# EAGLE design AS3364 waveform VCA 0402 DIL v1.0-for design block (EAGLE 9.6.2)
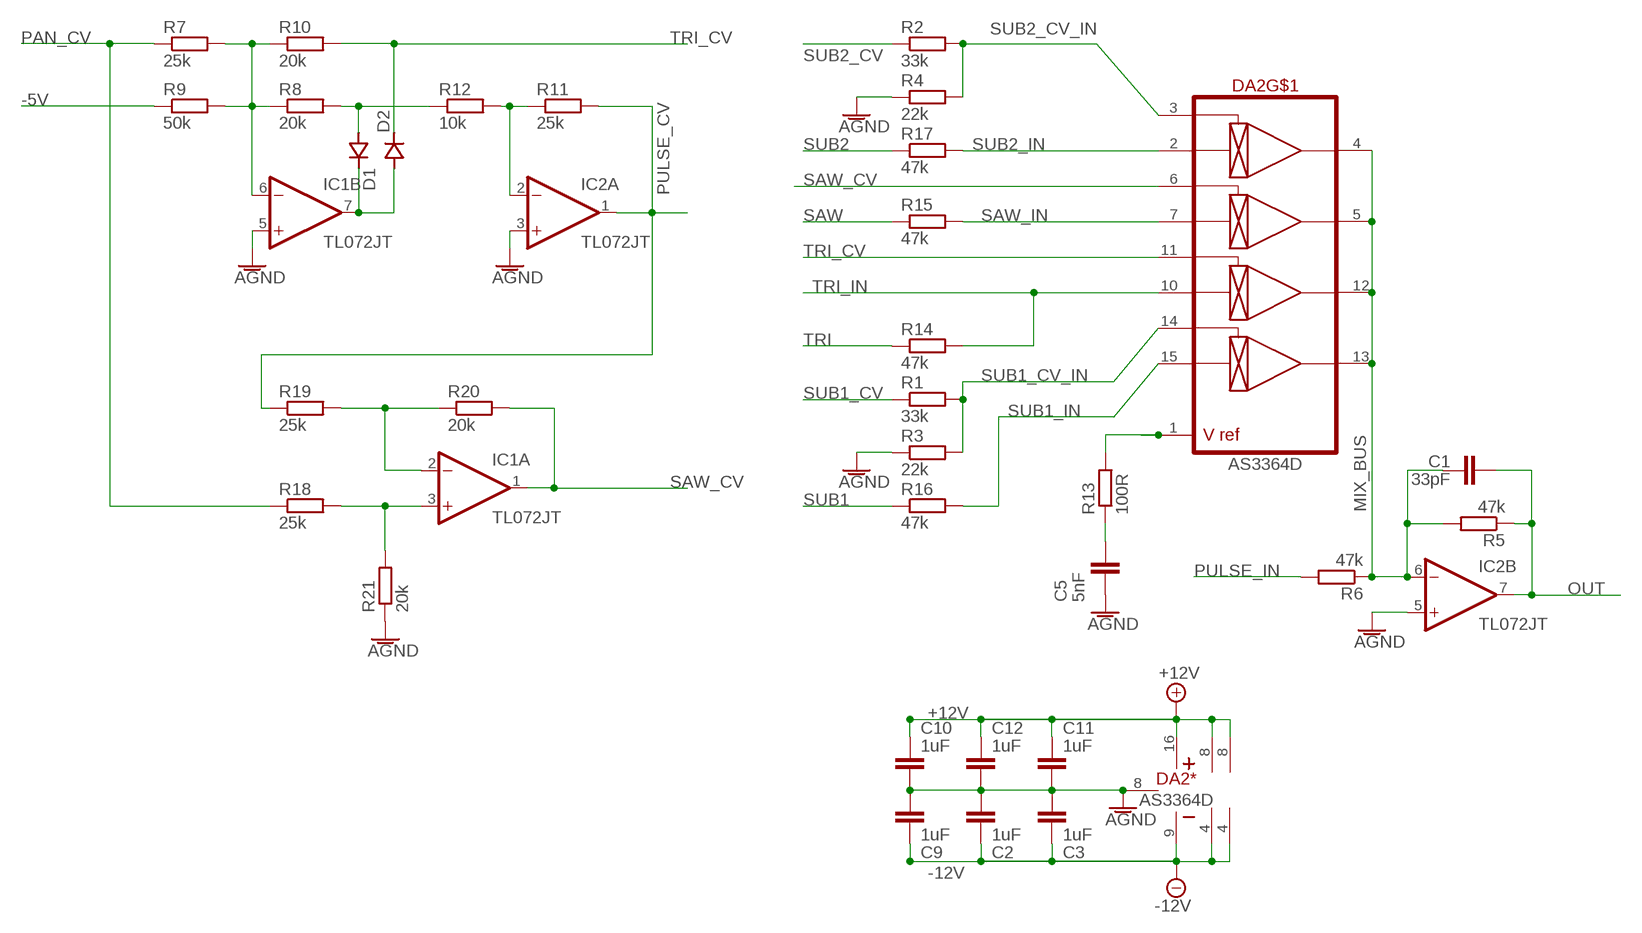
[diagram p0: schematic, sheet 1]

## Parts
C1  33pF  C-EU-J  [C0402-J]
C2  1uF  C-EU-J  [C0402-J]
C3  1uF  C-EU-J  [C0402-J]
C5  5nF  C-EU-J  [C0402-J]
C9  1uF  C-EU-J  [C0402-J]
C10  1uF  C-EU-J  [C0402-J]
C11  1uF  C-EU-J  [C0402-J]
C12  1uF  C-EU-J  [C0402-J]
D1  DIODESOD323  [SOD323J]
D2  DIODESOD323  [SOD323J]
DA2  AS3364D  [DIL16J]
IC1  TL072JT  [TSSOP8J]
IC2  TL072JT  [TSSOP8J]
R1  33k  R-EU_R0402  [R0402]
R2  33k  R-EU_R0402  [R0402]
R3  22k  R-EU_R0402  [R0402]
R4  22k  R-EU_R0402  [R0402]
R5  47k  R-EU_R0402  [R0402]
R6  47k  R-EU_R0402  [R0402]
R7  25k  R-EU_R0402  [R0402]
R8  20k  R-EU_R0402  [R0402]
R9  50k  R-EU_R0402  [R0402]
R10  20k  R-EU_R0402  [R0402]
R11  25k  R-EU_R0402  [R0402]
R12  10k  R-EU_R0402  [R0402]
R13  100R  R-EU_R0402  [R0402]
R14  47k  R-EU_R0402  [R0402]
R15  47k  R-EU_R0402  [R0402]
R16  47k  R-EU_R0402  [R0402]
R17  47k  R-EU_R0402  [R0402]
R18  25k  R-EU_R0402  [R0402]
R19  25k  R-EU_R0402  [R0402]
R20  20k  R-EU_R0402  [R0402]
R21  20k  R-EU_R0402  [R0402]

## Nets
+12V: C10.2 C11.2 C12.2 DA2.16(*:V+) IC1.8(P:V+) IC2.8(P:V+)
-5V: R9.1
-12V: C2.1 C3.1 C9.1 DA2.9(*:V-) IC1.4(P:V-) IC2.4(P:V-)
AGND: C2.2 C3.2 C5.1 C9.2 C10.1 C11.1 C12.1 DA2.8(*:GND) IC1.5(B:+IN) IC2.3(A:+IN) IC2.5(B:+IN) R3.1 R4.1 R21.1
MIX_BUS: C1.2 DA2.4(OUT1) DA2.5(OUT2) DA2.12(OUT3) DA2.13(OUT4) IC2.6(B:-IN) R5.2 R6.1
N$2: DA2.1(VREF) R13.2
N$6: D1.1(C) D2.2(A) IC1.7(B:OUT)
N$8: IC1.6(B:-IN) R7.2 R8.1 R9.2 R10.1
N$11: IC1.3(A:+IN) R18.2 R21.2
N$14: C5.2 R13.1
N$15: IC1.2(A:-IN) R19.2 R20.1
N$18: IC2.2(A:-IN) R11.1 R12.2
N$19: D1.2(A) R8.2 R12.1
OUT: C1.1 IC2.7(B:OUT) R5.1
PAN_CV: R7.1 R18.1
PULSE_CV: IC2.1(A:OUT) R11.2 R19.1
PULSE_IN: R6.2
SAW: R15.1
SAW_CV: DA2.6(CV2) IC1.1(A:OUT) R20.2
SAW_IN: DA2.7(IN2) R15.2
SUB1: R16.1
SUB1_CV: R1.1
SUB1_CV_IN: DA2.14(CV4) R1.2 R3.2
SUB1_IN: DA2.15(IN4) R16.2
SUB2: R17.1
SUB2_CV: R2.1
SUB2_CV_IN: DA2.3(CV1) R2.2 R4.2
SUB2_IN: DA2.2(IN1) R17.2
TRI: R14.1
TRI_CV: D2.1(C) DA2.11(CV3) R10.2
TRI_IN: DA2.10(IN3) R14.2

## Library data of the parts
C1-C3 C5 C9-C12 = joakim:C-EU-J: CAPACITOR, European symbol
D1 D2 = joakim:DIODE: DIODE; MPN: CDSOD323-T05C; OC_FARNELL: 1824860; OC_NEWARK: 79R6078
DA2 = joakim:AS3364: AS3364 quad linear VCA, CEM3360 style. CV is 0 to 2V Vcc-Vee = 26V max, so +/-12V or +15V/-9V
IC1 IC2 = joakim:TL072J: OP AMP
R1-R21 = rcl:R-EU_: RESISTOR, European symbol; SPICEPREFIX: R

## Board
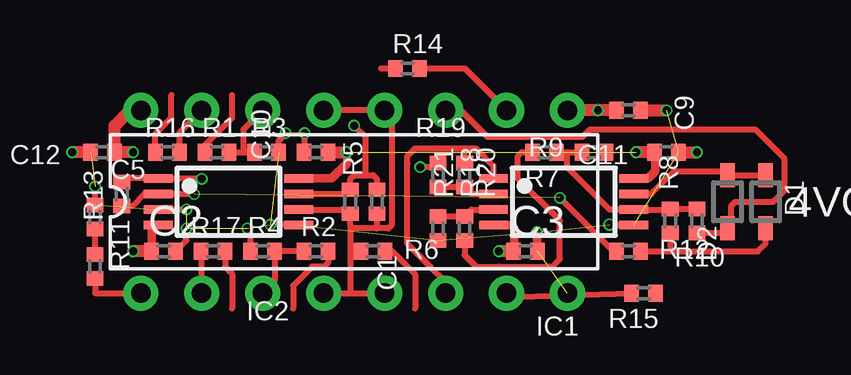
[diagram p1: board, top side]
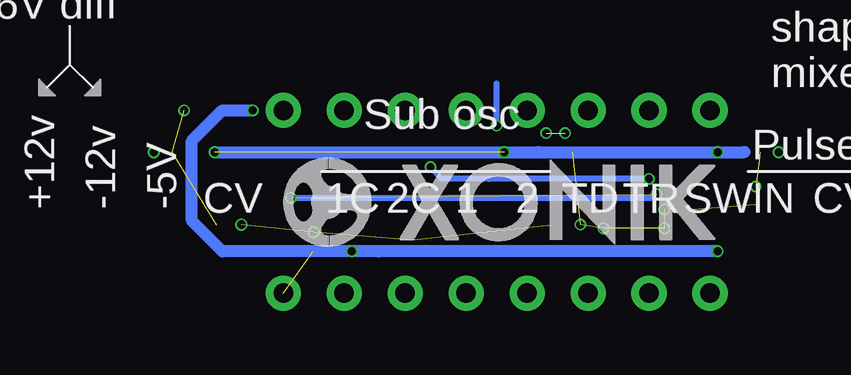
[diagram p2: board, bottom side, seen from below]

No outline drawn. Coordinates in mm, seen from the top.
Copper layers (1*16): Top 0.035mm / dielectric 1.6mm / Bottom 0.035mm
Design rules "jlcpcb-2layers": minimum track width 5mil, minimum drill 0.3mm, track to track 5mil, track to pad 5mil, pad to pad 5mil, via to via 5mil, smd to smd 5mil, copper to edge 0.2mm, drill to drill 6mil, minimum pad ring 10mil, minimum via ring 3mil, stop-mask expansion 4mil, vias tented up to drill 0mil, thermal gap 10mil

### Footprints (pad centres in the part's own frame; a part is rotated, then mirrored left to right if it is on the bottom)
C0402-J = smd 0.6 x 0.7: 1 -0.5,0; 2 0.5,0
SOD323J = smd 1 x 0.6: 1 -1.1,0; 2 1.1,0
DIL16J = drill 0.813: 1 -8.89,-3.81; 2 -6.35,-3.81; 3 -3.81,-3.81; 4 -1.27,-3.81; 5 1.27,-3.81; 6 3.81,-3.81; 7 6.35,-3.81; 8 8.89,-3.81; 9 8.89,3.81; 10 6.35,3.81; 11 3.81,3.81; 12 1.27,3.81; 13 -1.27,3.81; 14 -3.81,3.81; 15 -6.35,3.81; 16 -8.89,3.81
TSSOP8J = smd 1.2 x 0.35: 1 -2.925,0.975; 2 -2.925,0.325; 3 -2.925,-0.325; 4 -2.925,-0.975; 5 2.925,-0.975; 6 2.925,-0.325; 7 2.925,0.325; 8 2.925,0.975
R0402 = smd 0.6 x 0.7: 1 -0.5,0; 2 0.5,0

### Placement (x,y rotation side)
C1  19.05,5.08 270 top
C2  10.16,3.02 0 top
C3  25.24,3.02 0 top
C5  7.3,4.45 270 top
C9  29.53,8.89 0 top
C10  16.51,7.14 0 top
C11  31.11,7.14 180 top
C12  7.62,7.14 0 top
D1  35.24,5.08 270 top
D2  33.66,5.08 90 top
DA2  18.1,5.08 0 top
IC1  26.83,5.08 0 top
IC2  12.86,5.08 0 top
R1  12.38,7.14 0 top
R2  16.51,3.02 180 top
R3  14.45,7.14 180 top
R4  14.29,3.02 0 top
R5  17.94,5.08 270 top
R6  18.89,3.02 0 top
R7  26.04,7.14 0 top
R8  31.27,4.29 270 top
R9  28.1,7.14 180 top
R10  32.38,4.29 270 top
R11  8.41,5.4 90 top
R12  29.53,3.02 180 top
R13  7.3,2.38 270 top
R14  20.32,10.64 0 top
R15  30.16,1.27 180 top
R16  10.32,7.14 0 top
R17  12.22,3.02 180 top
R18  22.7,3.97 90 top
R19  21.59,6.19 270 top
R20  22.7,6.19 90 top
R21  21.59,3.97 90 top
U$1  [XONIK_LOGO_18]  26.99,3.23 0 bottom

### Tracks (layer width: path | path; a pad name or v marks a point on that pad's centre or on a via)
+12V  (via drill 0.33)  (3 unrouted)
  Top 0.356: IC2.8 17.17,6.05 17.78,6.67 v17.78,7.14 | IC1.8 30.34,6.05 30.64,6.35 30.64,7.12 C11.2
  Top 0.508: C10.2 v17.78,7.14 | v8.89,7.14 C12.2 8.12,8.26 8.76,8.89 DA2.16 | C11.2 v29.84,7.14
  Bottom 0.508: 7.78,7.14 v8.89,7.14 16.35,7.14 v17.78,7.14 v29.84,7.14
-12V  (via drill 0.33)
  Top 0.356: C2.1 9.66,3.65 9.66,4.11 IC2.4 | IC1.4 24.63,4.11 24.77,3.97 24.77,3.04 C3.1
  Top 0.508: DA2.9 C9.1 v28.26,8.89 | C2.1 v8.89,3.02 | C3.1 v24.13,3.02
  Bottom 0.508: v8.89,3.02 23.02,3.02 | 23.02,3.02 v24.13,3.02 | 23.02,3.02 v24.13,3.02 | v24.13,3.02 29.53,3.02 30.8,4.29 30.8,7.62 29.53,8.89 v28.26,8.89
AGND  (via drill 0.33, 0.35)  (13 unrouted)
  Top 0.254: IC1.5 28.76,4.11 v28.73,4.13 | C5.1 v7.3,5.71 | R3.1 14.95,7.62 15.24,7.91 v15.24,7.94 | v16.03,7.94 16.01,7.91 C10.1 | IC2.5 15.76,4.13 v14.61,4.13 | IC2.3 9.94,4.76 v11.11,4.76 | C2.2 11.11,3.47 v11.11,3.97 | R4.1 13.79,3.83 v13.65,3.97
  Top 0.356: C3.2 25.72,3.04 v25.72,3.81
  Top 0.508: C9.2 v31.11,8.89 | C11.1 v32.38,7.14 | C12.1 v6.35,7.14
MIX_BUS
  Top 0.254: DA2.4 17.94,1.27 | 17.94,1.27 DA2.5 | DA2.13 DA2.12 19.68,8.57 19.68,6.19 19.68,4.13 19.53,3.97 19.05,3.97 | 19.05,3.97 17.94,3.97 | IC2.6 17.76,4.75 R5.2 17.94,4.13 17.94,3.97 | C1.2 19.05,3.97 | 17.94,3.97 17.94,3.17 17.94,3.02 | 17.94,3.02 R6.1 | 17.94,3.02 17.94,1.27
N$2
  Top 0.254: DA2.1 7.3,1.27 R13.2
N$6
  Top 0.254: IC1.7 30.49,5.41 31.43,6.35 33.48,6.35 D2.2 D1.1
N$8
  Top 0.254: IC1.6 28.74,4.75 26.99,6.51 26.99,7.14 | R7.2 26.99,7.14 | 26.99,7.14 R9.2 | 29.79,4.79 IC1.6 | IC1.6 31.24,4.75 R8.1 R10.1
N$11
  Top 0.254: 23.91,4.76 IC1.3 22.99,4.75 R18.2 R21.2
N$14
  Top 0.254: R13.1 C5.2
N$15
  Top 0.254: 23.91,5.4 IC1.2 22.99,5.41 R20.1 R19.2
N$18  (via drill 0.33)  (3 unrouted)
  Top 0.254: R11.1 8.87,4.9 9.37,5.41 IC2.2 v11.42,5.41 v11.43,5.4 | v26.67,5.24 28.89,3.02 R12.2
  Bottom 0.254: v26.67,5.24 11.59,5.24 v11.43,5.4
N$19
  Top 0.254: R8.2 31.27,3.02 | R12.1 31.27,3.02 | D1.2 35.24,3.33 34.92,3.02 31.27,3.02
OUT  (via drill 0.33)
  Top 0.254: IC2.7 17.76,5.41 R5.1 17.94,6.03 18.1,6.19 18.57,6.19 | 18.57,6.19 18.89,6.19 19.05,6.03 C1.1 | v18.1,8.26 18.57,7.78 18.57,6.19
  Bottom 0.254: v18.1,8.26 18.1,10
PAN_CV
  Top 0.254: R18.1 22.7,2.86 23.18,2.38 24.13,2.38 26.19,2.38 26.35,2.38 26.67,2.7 26.67,4.29 26.51,4.45 24.92,6.03 24.92,6.99 25.08,7.14 R7.1
PULSE_CV  (via drill 0.33)
  Top 0.254: R11.2 8.57,6.05 IC2.1 11.72,6.05 v11.75,6.03 | R19.1 21.42,6.52 v20.85,6.52
  Bottom 0.254: v11.75,6.03 18.41,6.03 20.38,6.03 20.38,6.04 v20.85,6.52
PULSE_IN
  Top 0.254: R6.2 19.68,3.02 20.64,2.06 20.64,0.64
SAW_CV
  Top 0.254: 23.88,6.03 IC1.1 23.9,6.58 23.18,7.3 22.7,7.3 | DA2.6 21.91,1.75 21.27,2.38 20.32,3.33 20.32,6.67 20.32,6.99 20.64,7.3 22.7,7.3 | R20.2 22.7,7.3
SAW_IN
  Top 0.254: DA2.7 24.29,1.11 R15.2
SUB1
  Top 0.254: R16.1 9.82,7.91 10.48,8.57 10.48,9.53
SUB1_CV
  Top 0.254: R1.1 11.88,7.44 13.02,8.57 13.02,9.53
SUB1_CV_IN
  Top 0.254: R1.2 13.49,7.14 | 13.49,7.14 13.65,7.14 R3.2 | 13.49,7.14 13.49,8.1 DA2.14
SUB1_IN
  Top 0.254: DA2.15 10.82,7.96 R16.2
SUB2
  Top 0.254: R17.1 12.72,2.38 13.02,2.09 13.02,0.64
SUB2_CV
  Top 0.254: R2.1 17.01,2.54 16.85,2.38 16.35,2.38 15.56,1.59 15.56,0.64
SUB2_CV_IN
  Top 0.254: R2.2 R4.2 14.79,1.77 DA2.3
SUB2_IN
  Top 0.254: R17.2 11.72,1.29 DA2.2
TRI
  Top 0.254: 19.21,10.64 R14.1
TRI_CV
  Top 0.254: R10.2 33.46,3.79 D2.1 33.81,4.14 33.81,4.92 33.97,5.08 35.56,5.08 36.04,5.56 36.04,6.86 34.8,8.1 27.94,8.1 27.62,7.78 23.65,7.78 23.5,7.94 22.54,8.89 DA2.11
TRI_IN
  Top 0.254: R14.2 22.7,10.64 DA2.10

### Text on the board
tNames: AS3364 | v1 | 4VOB
bNames: NB: Max / 26V diff | Wave- / shape / mixer | Sub osc | Pulse | O | CV | IN | SW | TR | TD | 2 | 1 | 2C | 1C | CV | -5V | -12v | +12v | AGND